# Altium schematic sheet Main.SchDoc
size A3; SheetNumber: 1; SheetTotal: 6
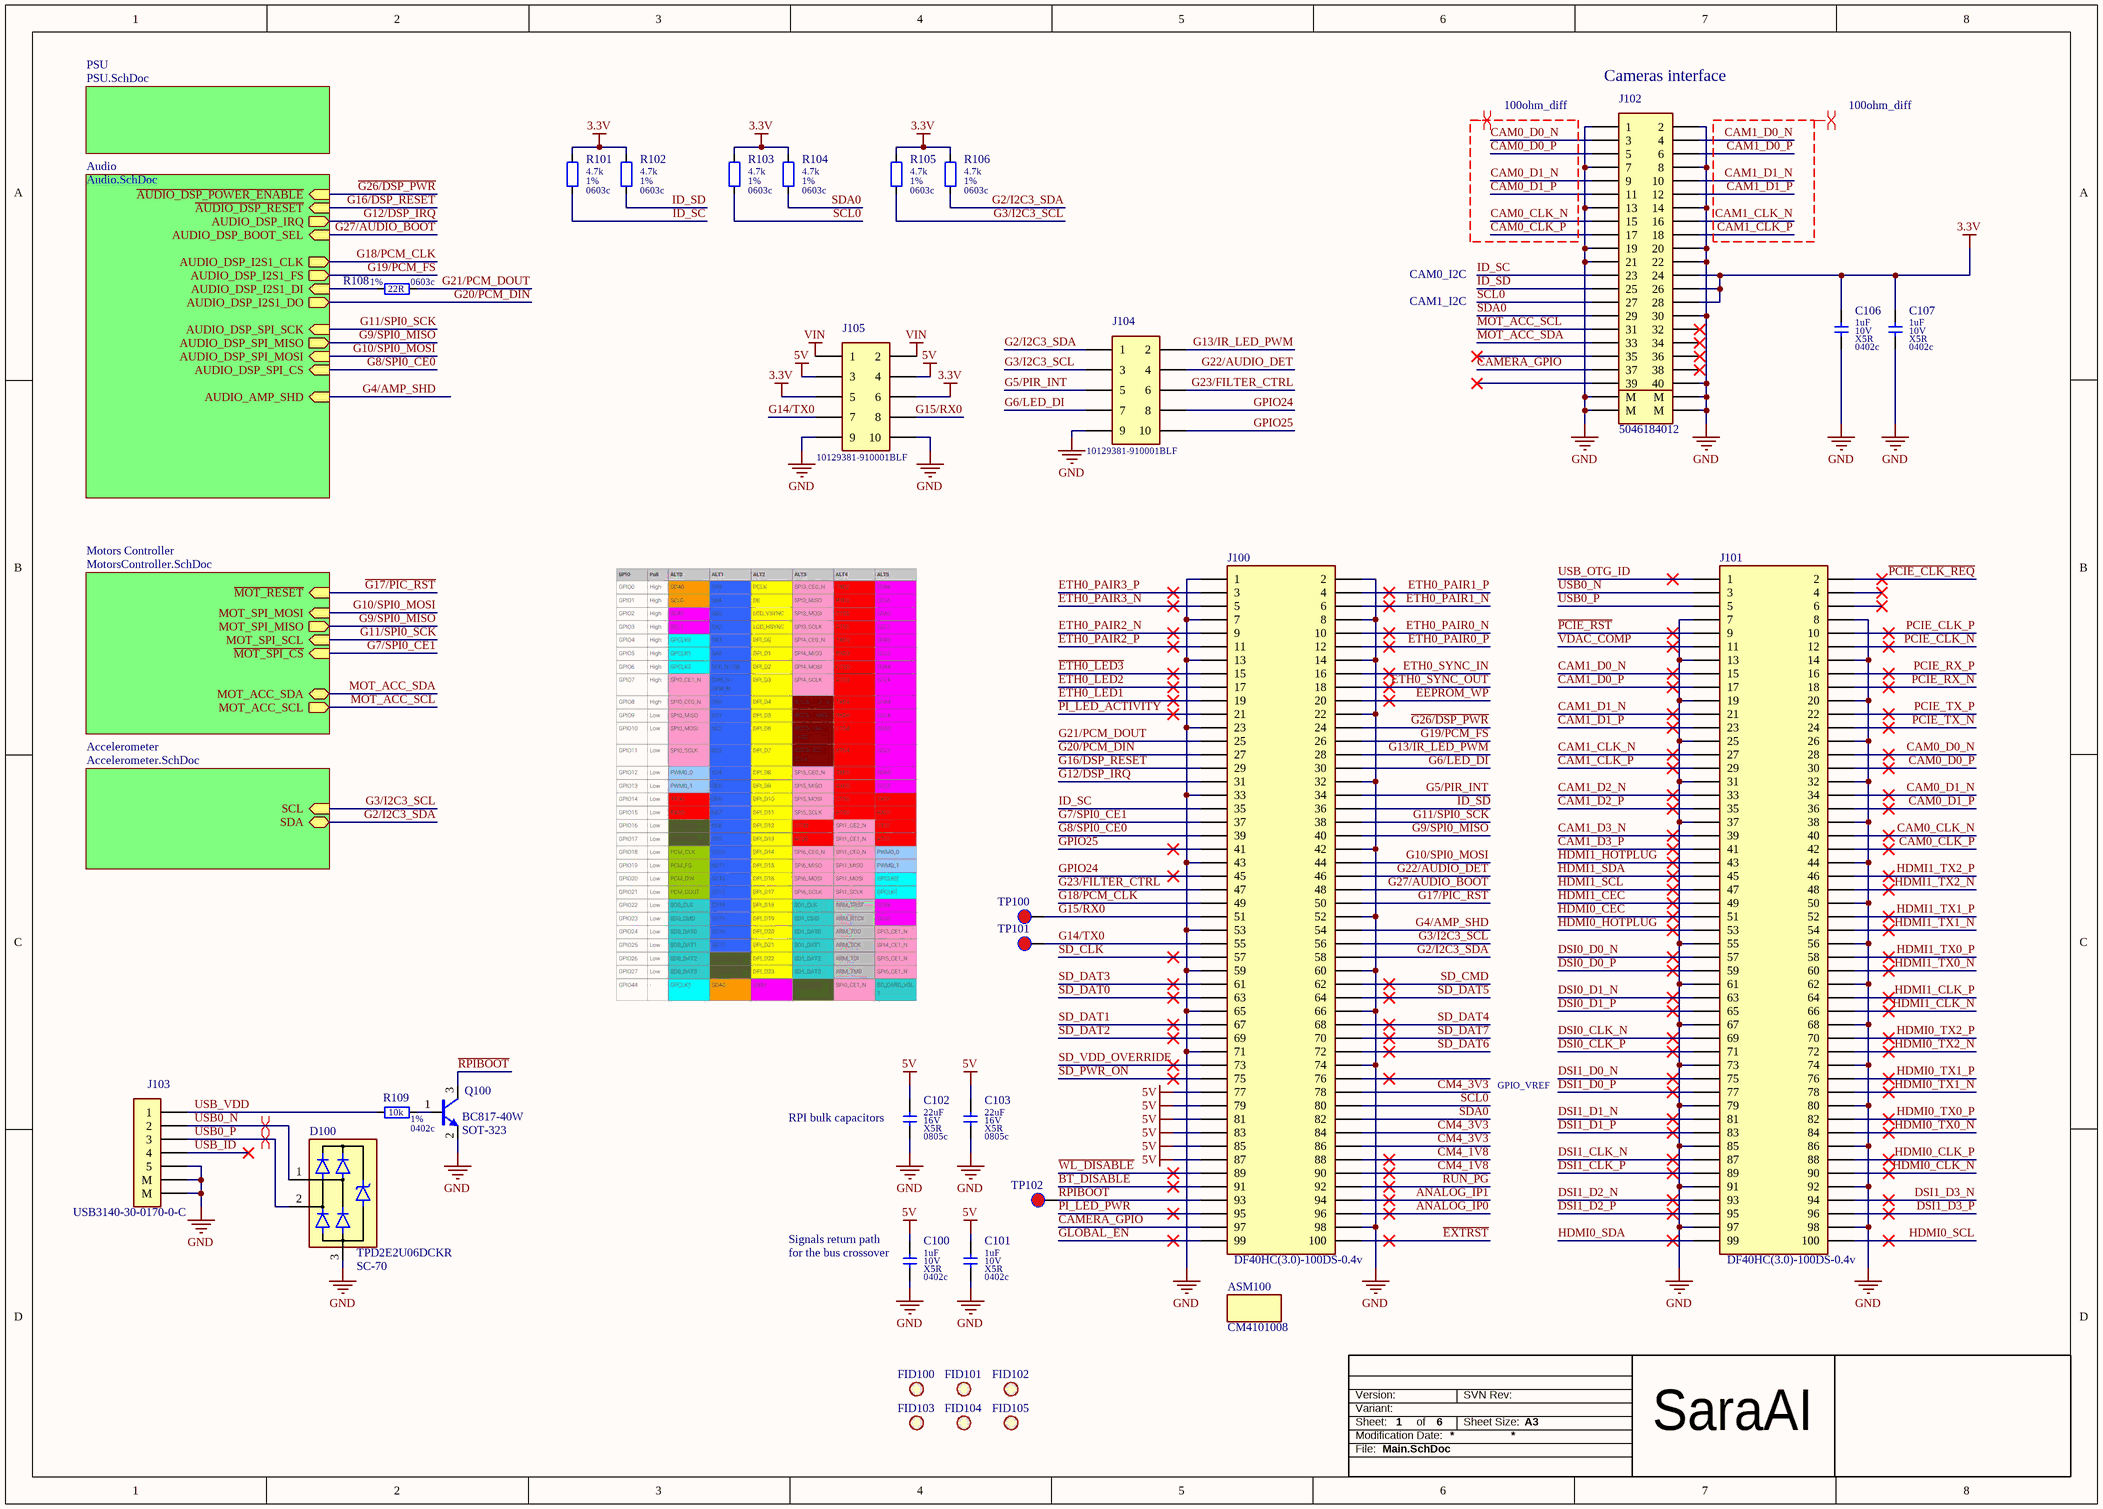
[diagram p0: Main.SchDoc]

## Parts
ASM100  CM4101008  [RASPBERRY PI CM4 EMMC]
C100  11 Parameter 4: X5R  07 Package: 0402c  08 Parameter 1: 1uF  09 Parameter 2: 10V  [CAPC1005X60L]  (hidden comment: CL05A105KP5NNNC)
C101  11 Parameter 4: X5R  07 Package: 0402c  08 Parameter 1: 1uF  09 Parameter 2: 10V  [CAPC1005X60L]  (hidden comment: CL05A105KP5NNNC)
C102  11 Parameter 4: X5R  07 Package: 0805c  08 Parameter 1: 22uF  09 Parameter 2: 16V  [CAPC2013X145L]  (hidden comment: CL21A226MOQNNNE)
C103  11 Parameter 4: X5R  07 Package: 0805c  08 Parameter 1: 22uF  09 Parameter 2: 16V  [CAPC2013X145L]  (hidden comment: CL21A226MOQNNNE)
C106  11 Parameter 4: X5R  07 Package: 0402c  08 Parameter 1: 1uF  09 Parameter 2: 10V  [CAPC1005X60L]  (hidden comment: CL05A105KP5NNNC)
C107  11 Parameter 4: X5R  07 Package: 0402c  08 Parameter 1: 1uF  09 Parameter 2: 10V  [CAPC1005X60L]  (hidden comment: CL05A105KP5NNNC)
D100  07 Package: SC-70  [SOT65P210X110-3L]  (hidden comment: TPD2E2U06DCKR)
FID100  FIDUCIAL  [FIDUCIAL 2MM]  (value not drawn)  (no BOM)
FID101  FIDUCIAL  [FIDUCIAL 2MM]  (value not drawn)  (no BOM)
FID102  FIDUCIAL  [FIDUCIAL 2MM]  (value not drawn)  (no BOM)
FID103  FIDUCIAL  [FIDUCIAL 2MM]  (value not drawn)  (no BOM)
FID104  FIDUCIAL  [FIDUCIAL 2MM]  (value not drawn)  (no BOM)
FID105  FIDUCIAL  [FIDUCIAL 2MM]  (value not drawn)  (no BOM)
J100  DF40HC(3.0)-100DS-0.4v  [DF40HC(3.0)-100DS-0.4V]
J101  DF40HC(3.0)-100DS-0.4v  [DF40HC(3.0)-100DS-0.4V]
J102  5046184012  [MOLEX 5046184012]
J103  USB3140-30-0170-0-C  [USB3140-30-0170-0-C]
J104  10129381-910001BLF  [Goldpin 2.54 2x5]
J105  10129381-910001BLF  [Goldpin 2.54 2x5]
Q100  07 Package: SOT-323  [SOT65P210X110-3L]  (hidden comment: BC817-40W)
R101  07 Package: 0603c  09 Parameter 2: 1%  08 Parameter 1: 4.7k  [RESC1608X55L]  (hidden comment: RC0603FR-074K7L)
R102  07 Package: 0603c  09 Parameter 2: 1%  08 Parameter 1: 4.7k  [RESC1608X55L]  (hidden comment: RC0603FR-074K7L)
R103  07 Package: 0603c  09 Parameter 2: 1%  08 Parameter 1: 4.7k  [RESC1608X55L]  (hidden comment: RC0603FR-074K7L)
R104  07 Package: 0603c  09 Parameter 2: 1%  08 Parameter 1: 4.7k  [RESC1608X55L]  (hidden comment: RC0603FR-074K7L)
R105  07 Package: 0603c  09 Parameter 2: 1%  08 Parameter 1: 4.7k  [RESC1608X55L]  (hidden comment: RC0603FR-074K7L)
R106  07 Package: 0603c  09 Parameter 2: 1%  08 Parameter 1: 4.7k  [RESC1608X55L]  (hidden comment: RC0603FR-074K7L)
R108  07 Package: 0603c  09 Parameter 2: 1%  08 Parameter 1: 22R  [RESC1608X55L]  (hidden comment: RC0603FR-0722RL)
R109  07 Package: 0402c  09 Parameter 2: 1%  08 Parameter 1: 10k  [RESC1005X40L]  (hidden comment: RC0402FR-0710KL)
TP100  TESTPAD  [TP 1.2mm]  (value not drawn)  (no BOM)
TP101  TESTPAD  [TP 1.2mm]  (value not drawn)  (no BOM)
TP102  TESTPAD  [TP 1.2mm]  (value not drawn)  (no BOM)

## Sub-sheets
Accelerometer = Accelerometer.SchDoc: SCL (in), SDA (bidir)
Audio = Audio.SchDoc: AUDIO_DSP_I2S1_CLK (out), AUDIO_DSP_I2S1_FS (out), AUDIO_DSP_I2S1_DI (in), AUDIO_DSP_I2S1_DO (out), AUDIO_DSP_SPI_SCK (in), AUDIO_DSP_SPI_CS (in), AUDIO_AMP_SHD (in), AUDIO_DSP_SPI_MISO (out), AUDIO_DSP_SPI_MOSI (in), ~{AUDIO_DSP_RESET} (in), AUDIO_DSP_BOOT_SEL (in), AUDIO_DSP_IRQ (out), ~{AUDIO_DSP_POWER_ENABLE} (in)
Motors Controller = MotorsController.SchDoc: MOT_ACC_SDA (bidir), MOT_ACC_SCL (out), ~{MOT_RESET} (in), MOT_SPI_SCL (in), ~{MOT_SPI_CS} (in), MOT_SPI_MOSI (in), MOT_SPI_MISO (out)
PSU = PSU.SchDoc: no entries

## Nets
3.3V: C106.2 C107.2 J102.24 J102.26 J102.28 J105.5 J105.6 R101.2 R102.2 R103.2 R104.2 R105.2 R106.2
5V: C100.2 C101.2 C102.2 C103.2 J100.77 J100.79 J100.81 J100.83 J100.85 J100.87 J105.3 J105.4
GND: C100.1 C101.1 C102.1 C103.1 C106.1 C107.1 D100.3 J100.1 J100.2 J100.7 J100.8 J100.13 J100.14 J100.22 J100.23 J100.32 J100.33 J100.42 J100.43 J100.52 J100.53 J100.59 J100.60 J100.65 J100.66 J100.71 J100.74 J100.98 J101.7 J101.8 J101.13 J101.14 J101.19 J101.20 J101.25 J101.26 J101.31 J101.32 J101.37 J101.38 J101.44 J101.50 J101.55 J101.56 J101.61 J101.62 J101.67 J101.68 J101.73 J101.74 J101.79 J101.80 J101.85 J101.86 J101.91 J101.92 J101.97 J101.98 J102.1 J102.2 J102.7 J102.8 J102.13 J102.14 J102.19 J102.20 J102.21 J102.22 J102.30 J102.40 J102.41(M) J102.42(M) J102.43(M) J102.44(M) J103.5 J103.MNT1(M) J103.MNT2(M) J104.9 J105.9 J105.10 Q100.2(E)
VIN: J105.1 J105.2
~{BT_DISABLE}: J100.91
~{EEPROM_WP}: J100.20
~{ETH0_LED1}: J100.19
~{ETH0_LED2}: J100.17
~{ETH0_LED3}: J100.15
~{EXTRST}: J100.100
~{G7/SPI0_CE1}: J100.37 ; sheet Motors Controller/~{MOT_SPI_CS}
~{G8/SPI0_CE0}: J100.39 ; sheet Audio/AUDIO_DSP_SPI_CS
~{G16/DSP_RESET}: J100.29 ; sheet Audio/~{AUDIO_DSP_RESET}
~{G17/PIC_RST}: J100.50 ; sheet Motors Controller/~{MOT_RESET}
~{G26/DSP_PWR}: J100.24 ; sheet Audio/~{AUDIO_DSP_POWER_ENABLE}
~{PCIE_CLK_REQ}: J101.2
~{PCIE_RST}: J101.9
~{PI_LED_ACTIVITY}: J100.21
~{PI_LED_PWR}: J100.95
~{RPIBOOT}: J100.93 Q100.3(C) TP102.1
~{WL_DISABLE}: J100.89
ANALOG_IP0: J100.96
ANALOG_IP1: J100.94
CAM0_CLK_N: J101.40 J102.15
CAM0_CLK_P: J101.42 J102.17
CAM0_D0_N: J101.28 J102.3
CAM0_D0_P: J101.30 J102.5
CAM0_D1_N: J101.34 J102.9
CAM0_D1_P: J101.36 J102.11
CAM1_CLK_N: J101.27 J102.16
CAM1_CLK_P: J101.29 J102.18
CAM1_D0_N: J101.15 J102.4
CAM1_D0_P: J101.17 J102.6
CAM1_D1_N: J101.21 J102.10
CAM1_D1_P: J101.23 J102.12
CAM1_D2_N: J101.33
CAM1_D2_P: J101.35
CAM1_D3_N: J101.39
CAM1_D3_P: J101.41
CAMERA_GPIO: J100.97 J102.37
CM4_1V8: J100.88 J100.90
CM4_3V3: J100.78 J100.84 J100.86
DSI0_CLK_N: J101.69
DSI0_CLK_P: J101.71
DSI0_D0_N: J101.57
DSI0_D0_P: J101.59
DSI0_D1_N: J101.63
DSI0_D1_P: J101.65
DSI1_CLK_N: J101.87
DSI1_CLK_P: J101.89
DSI1_D0_N: J101.75
DSI1_D0_P: J101.77
DSI1_D1_N: J101.81
DSI1_D1_P: J101.83
DSI1_D2_N: J101.93
DSI1_D2_P: J101.95
DSI1_D3_N: J101.94
DSI1_D3_P: J101.96
ETH0_PAIR0_N: J100.10
ETH0_PAIR0_P: J100.12
ETH0_PAIR1_N: J100.6
ETH0_PAIR1_P: J100.4
ETH0_PAIR2_N: J100.9
ETH0_PAIR2_P: J100.11
ETH0_PAIR3_N: J100.5
ETH0_PAIR3_P: J100.3
ETH0_SYNC_IN: J100.16
ETH0_SYNC_OUT: J100.18
G2/I2C3_SDA: J100.58 J104.1 R106.1 ; sheet Accelerometer/SDA
G3/I2C3_SCL: J100.56 J104.3 R105.1 ; sheet Accelerometer/SCL
G4/AMP_SHD: J100.54 ; sheet Audio/AUDIO_AMP_SHD
G5/PIR_INT: J100.34 J104.5
G6/LED_DI: J100.30 J104.7
G9/SPI0_MISO: J100.40 ; sheet Audio/AUDIO_DSP_SPI_MISO, sheet Motors Controller/MOT_SPI_MISO
G10/SPI0_MOSI: J100.44 ; sheet Audio/AUDIO_DSP_SPI_MOSI, sheet Motors Controller/MOT_SPI_MOSI
G11/SPI0_SCK: J100.38 ; sheet Audio/AUDIO_DSP_SPI_SCK, sheet Motors Controller/MOT_SPI_SCL
G12/DSP_IRQ: J100.31 ; sheet Audio/AUDIO_DSP_IRQ
G13/IR_LED_PWM: J100.28 J104.2
G14/TX0: J100.55 J105.7 TP101.1
G15/RX0: J100.51 J105.8 TP100.1
G18/PCM_CLK: J100.49 ; sheet Audio/AUDIO_DSP_I2S1_CLK
G19/PCM_FS: J100.26 ; sheet Audio/AUDIO_DSP_I2S1_FS
G20/PCM_DIN: J100.27 ; sheet Audio/AUDIO_DSP_I2S1_DO
G21/PCM_DOUT: J100.25 R108.2
G22/AUDIO_DET: J100.46 J104.4
G23/FILTER_CTRL: J100.47 J104.6
G27/AUDIO_BOOT: J100.48 ; sheet Audio/AUDIO_DSP_BOOT_SEL
GLOBAL_EN: J100.99
GPIO24: J100.45 J104.8
GPIO25: J100.41 J104.10
HDMI0_CEC: J101.51
HDMI0_CLK_N: J101.90
HDMI0_CLK_P: J101.88
HDMI0_HOTPLUG: J101.53
HDMI0_SCL: J101.100
HDMI0_SDA: J101.99
HDMI0_TX0_N: J101.84
HDMI0_TX0_P: J101.82
HDMI0_TX1_N: J101.78
HDMI0_TX1_P: J101.76
HDMI0_TX2_N: J101.72
HDMI0_TX2_P: J101.70
HDMI1_CEC: J101.49
HDMI1_CLK_N: J101.66
HDMI1_CLK_P: J101.64
HDMI1_HOTPLUG: J101.43
HDMI1_SCL: J101.47
HDMI1_SDA: J101.45
HDMI1_TX0_N: J101.60
HDMI1_TX0_P: J101.58
HDMI1_TX1_N: J101.54
HDMI1_TX1_P: J101.52
HDMI1_TX2_N: J101.48
HDMI1_TX2_P: J101.46
ID_SC: J100.35 J102.23 R101.1
ID_SD: J100.36 J102.25 R102.1
MOT_ACC_SCL: J102.31 ; sheet Motors Controller/MOT_ACC_SCL
MOT_ACC_SDA: J102.33 ; sheet Motors Controller/MOT_ACC_SDA
PCIE_CLK_N: J101.12
PCIE_CLK_P: J101.10
PCIE_RX_N: J101.18
PCIE_RX_P: J101.16
PCIE_TX_N: J101.24
PCIE_TX_P: J101.22
RUN_PG: J100.92
SCL0: J100.80 J102.27 R103.1
SD_CLK: J100.57
SD_CMD: J100.62
SD_DAT0: J100.63
SD_DAT1: J100.67
SD_DAT2: J100.69
SD_DAT3: J100.61
SD_DAT4: J100.68
SD_DAT5: J100.64
SD_DAT6: J100.72
SD_DAT7: J100.70
SD_PWR_ON: J100.75
SD_VDD_OVERRIDE: J100.73
SDA0: J100.82 J102.29 R104.1
USB0_N: D100.1 J101.3 J103.2
USB0_P: D100.2 J101.5 J103.3
USB_ID: J103.4
USB_OTG_ID: J101.1
USB_VDD: J103.1 R109.2
VDAC_COMP: J101.11
NetQ100_1: Q100.1(B) R109.1
NetR108_1: R108.1 ; sheet Audio/AUDIO_DSP_I2S1_DI

Not connected (* = marked no-connect by the designer): J100 76*; J101 4* 6*; J102 32* 34* 35* 36* 38* 39*

## Layout directives
differential pair; differential pair class 100ohm_diff: CAM0_CLK_N, CAM0_CLK_P, CAM0_D0_N, CAM0_D0_P, CAM0_D1_N, CAM0_D1_P, CAM1_CLK_N, CAM1_CLK_P, CAM1_D0_N, CAM1_D0_P, CAM1_D1_N, CAM1_D1_P
differential pair; differential pair class USB: USB0_N, USB0_P

## Notes on the sheet
- (near J102) Cameras interface
- CAM0_I2C
- CAM1_I2C
- (near C102) RPI bulk capacitors
- GPIO_VREF
- (near C100) Signals return path
- (near C100) for the bus crossover
- Version:
- SVN Rev:
- Sheet:
- File:
- Modification Date:
- Variant:
- of
- Sheet Size:
- A3
- SaraAI

## Library data of the parts
ASM100 = 439: FAS SoM 1GB 8GB; 03 Manufacturer: Raspberry Pi; 00 Index: 439; 01 Name: IC PROCESSOR CM4101008 Raspberry Pi; 04 Main Group: IC; 05 Sub Group: PROCESSOR; 06 Assembly: FAS; 11 Parameter 4: SoM; 12 Parameter 5: 1GB; 13 Parameter 6: 8GB; 14 Modification Date: 08.02.2021; ComponentLink1Description: DATASHEET; ComponentLink1URL: https://datasheets.raspberrypi.org/cm4/cm4-datasheet.pdf; 02 MPN: CM4101008
C100 C101 C106 C107 = 154: SMT 0402c 1uF 10V 10% X5R 10.2MHz 85'C; 03 Manufacturer: Samsung; 00 Index: 154; 01 Name: CAPACITOR THICK FILM CL05A105KP5NNNC Samsung; 05 Sub Group: THICK FILM; 04 Main Group: CAPACITOR; 06 Assembly: SMT; 12 Parameter 5: 10.2MHz; 13 Parameter 6: 85'C; 14 Modification Date: 16.11.2020; ComponentLink1Description: DATASHEET; ComponentLink1URL: E:\Praca\Mindsailors\Mindsailors Altium\Database Library\Datasheets\CAPACITOR\Samsung CL05A105KP5NNNC.pdf; 02 MPN: CL05A105KP5NNNC; 10 Parameter 3: 10%
C102 C103 = 81: SMT 0805c 22uF 16V 20% X5R 1.6MHz 85'C; 03 Manufacturer: Samsung; 00 Index: 81; 01 Name: CAPACITOR CERAMIC CL21A226MOQNNNE Samsung; 05 Sub Group: CERAMIC; 04 Main Group: CAPACITOR; 06 Assembly: SMT; 12 Parameter 5: 1.6MHz; 13 Parameter 6: 85'C; 14 Modification Date: 16.11.2020; ComponentLink1Description: DATASHEET; ComponentLink1URL: E:\Praca\Mindsailors\Mindsailors Altium\Database Library\Datasheets\CAPACITOR\Samsung CL21A226MOQNNN.pdf; 02 MPN: CL21A226MOQNNNE; 10 Parameter 3: 20%
D100 = 445: SMT SC-70 6.5V 5.5A 85W Bidirectional 12.4V 10nA; 03 Manufacturer: Texas Instruments; 00 Index: 445; 01 Name: DIODE TVS/ESD TPD2E2U06DCKR Texas Instruments; 04 Main Group: DIODE; 05 Sub Group: TVS/ESD; Library Directory: sym_basics/; Fotprint Directory: fot_ipc/; 06 Assembly: SMT; 11 Parameter 4: Bidirectional; 12 Parameter 5: 12.4V; 13 Parameter 6: 10nA; 14 Modification Date: 10.02.2021; ComponentLink1Description: DATASHEET; ComponentLink1URL: https://www.ti.com/lit/ds/symlink/tpd2e2u06.pdf?ts=1612947447411&ref_url=https%253A%252F%252Fwww.ti.com%252Fsitesearch%252Fdocs%252Funiversalsearch.tsp%253FsearchTerm%253DTPD2E2U06; 10 Parameter 3: 85W; 09 Parameter 2: 5.5A; 08 Parameter 1: 6.5V; 02 MPN: TPD2E2U06DCKR
FID100-FID105 = 487: 00 Index: 487; 01 Name: FIDUCIAL; 14 Modification Date: 23.01.2021; 02 MPN: FIDUCIAL; 07 Package: *
J100 J101 = 440: SMT 2x50 0.4mm Female Straight; 03 Manufacturer: Hirose; 00 Index: 440; 01 Name: CONNECTOR PCB DF40HC(3.0)-100DS-0.4v Hirose; 04 Main Group: CONNECTOR; 05 Sub Group: PCB; 06 Assembly: SMT; 14 Modification Date: 08.02.2021; ComponentLink1Description: DATASHEET; ComponentLink1URL: https://www.hirose.com/en/product/document?clcode=CL0684-4151-0-51&productname=DF40HC(3.0)-100DS-0.4V(51&series=DF40&documenttype=2DDrawing&lang=en&documentid=0001001369; 10 Parameter 3: Female; 09 Parameter 2: 0.4mm; 08 Parameter 1: 2x50; 11 Parameter 4: Straight; 02 MPN: DF40HC(3.0)-100DS-0.4v; 07 Package: *
J102 = 509: SMT 2x20 0.35mm Straight 50V 0.3A; 03 Manufacturer: Molex; 00 Index: 509; 01 Name: CONNECTOR PCB 5046184012 Molex; 04 Main Group: CONNECTOR; 05 Sub Group: PCB; 06 Assembly: SMT; 13 Parameter 6: 0.3A; 14 Modification Date: 18.03.2021; ComponentLink1Description: DATASHEET; ComponentLink1URL: https://www.molex.com/molex/products/part-detail/pcb_receptacles/5046183012; 09 Parameter 2: 0.35mm; 08 Parameter 1: 2x20; 11 Parameter 4: Straight; 12 Parameter 5: 50V; 07 Package: *; 02 MPN: 5046184012
J103 = 980: SMD/THT USB 0.65mm Straight 30V 1A; 03 Manufacturer: GCT; 00 Index: 980; 01 Name: CONNECTOR WIRE USB3140-30-0170-0-C GCT; 04 Main Group: CONNECTOR; 05 Sub Group: WIRE; Library Directory: sym_basics/; Fotprint Directory: fot_other/; 06 Assembly: SMD/THT; 13 Parameter 6: 1A; 14 Modification Date: 05.01.2022; ComponentLink1Description: DATASHEET; ComponentLink1URL: https://pl.mouser.com/datasheet/2/837/USB3140-1948849.pdf; 09 Parameter 2: 0.65mm; 08 Parameter 1: USB; 11 Parameter 4: Straight; 12 Parameter 5: 30V; 07 Package: *; 02 MPN: USB3140-30-0170-0-C
J104 J105 = 981: THT 2X5 2.54mm Straight 110V 3A; 03 Manufacturer: Amphenol; 00 Index: 981; 01 Name: CONNECTOR WIRE 10129381-910001BLF Amphenol; 04 Main Group: CONNECTOR; 05 Sub Group: WIRE; Library Directory: sym_basics/; Fotprint Directory: fot_other/; 06 Assembly: THT; 13 Parameter 6: 3A; 14 Modification Date: 05.01.2022; ComponentLink1Description: DATASHEET; ComponentLink1URL: https://www.amphenol-icc.com/econostik-10129381910001blf.html; 09 Parameter 2: 2.54mm; 08 Parameter 1: 2X5; 11 Parameter 4: Straight; 12 Parameter 5: 110V; 07 Package: *; 02 MPN: 10129381-910001BLF
Q100 = 93: SMT SOT-323 NPN 45V 0.5A 0.2W; 03 Manufacturer: Nexperia; 00 Index: 93; 01 Name: TRANSISTOR BIPOLAR BC817-40W Nexperia; 04 Main Group: TRANSISTOR; 05 Sub Group: BIPOLAR; Library Directory: sym_basics/; Fotprint Directory: fot_ipc/; 06 Assembly: SMT; 13 Parameter 6: 0.2W; 14 Modification Date: 16.11.2020; ComponentLink1Description: DATASHEET; ComponentLink1URL: E:\Praca\Mindsailors\Mindsailors Altium\Database Library\Datasheets\TRANSISTOR\Nexperia BC817W Series.pdf; 08 Parameter 1: NPN; 11 Parameter 4: 45V; 12 Parameter 5: 0.5A; 02 MPN: BC817-40W
R101-R106 = 380: SMT 0603c 4.7k 1% 100mW 100ppm/K 75V; 03 Manufacturer: Yageo; 00 Index: 380; 01 Name: RESISTOR THICK FILM RC0603FR-074K7L Yageo; 05 Sub Group: THICK FILM; 04 Main Group: RESISTOR; 06 Assembly: SMT; 11 Parameter 4: 100ppm/K; 12 Parameter 5: 75V; 14 Modification Date: 25.01.2021; ComponentLink1Description: DATASHEET; ComponentLink1URL: https://www.yageo.com/upload/media/product/products/datasheet/rchip/PYu-RC_Group_51_RoHS_L_11.pdf; 10 Parameter 3: 100mW; 02 MPN: RC0603FR-074K7L
R108 = 318: SMT 0603c 22R 1% 100mW 100ppm/K 75V; 03 Manufacturer: Yageo; 00 Index: 318; 01 Name: RESISTOR THICK FILM RC0603FR-0722RL Yageo; 05 Sub Group: THICK FILM; Library Directory: sym_basics/; Fotprint Directory: fot_ipc/; 04 Main Group: RESISTOR; 06 Assembly: SMT; 11 Parameter 4: 100ppm/K; 12 Parameter 5: 75V; 14 Modification Date: 25.01.2021; ComponentLink1Description: DATASHEET; ComponentLink1URL: https://www.yageo.com/upload/media/product/products/datasheet/rchip/PYu-RC_Group_51_RoHS_L_11.pdf; 10 Parameter 3: 100mW; 02 MPN: RC0603FR-0722RL
R109 = 15: SMT 0402c 10k 1% 62.5mW 100ppm/K 50V; 03 Manufacturer: Yageo; 00 Index: 15; 01 Name: RESISTOR THICK FILM RC0402FR-0710KL Yageo; 05 Sub Group: THICK FILM; 04 Main Group: RESISTOR; 06 Assembly: SMT; 11 Parameter 4: 100ppm/K; 12 Parameter 5: 50V; 14 Modification Date: 16.11.2020; ComponentLink1Description: DATASHEET; ComponentLink1URL: E:\Praca\Mindsailors\Mindsailors Altium\Database Library\Datasheets\RESISTOR\Yageo RC_L Series.pdf; 10 Parameter 3: 62.5mW; 02 MPN: RC0402FR-0710KL
TP100 = 10: 00 Index: 10; 01 Name: PCB COMPONENT TESTPAD TESTPAD; 04 Main Group: PCB COMPONENT; Library Directory: sym_basics/; Fotprint Directory: fot_other/; 02 MPN: TESTPAD; 05 Sub Group: TESTPAD; 14 Modification Date: 16.11.2020
TP101 TP102 = 10: 00 Index: 10; 01 Name: PCB COMPONENT TESTPAD TESTPAD; 04 Main Group: PCB COMPONENT; 02 MPN: TESTPAD; 05 Sub Group: TESTPAD; 14 Modification Date: 16.11.2020